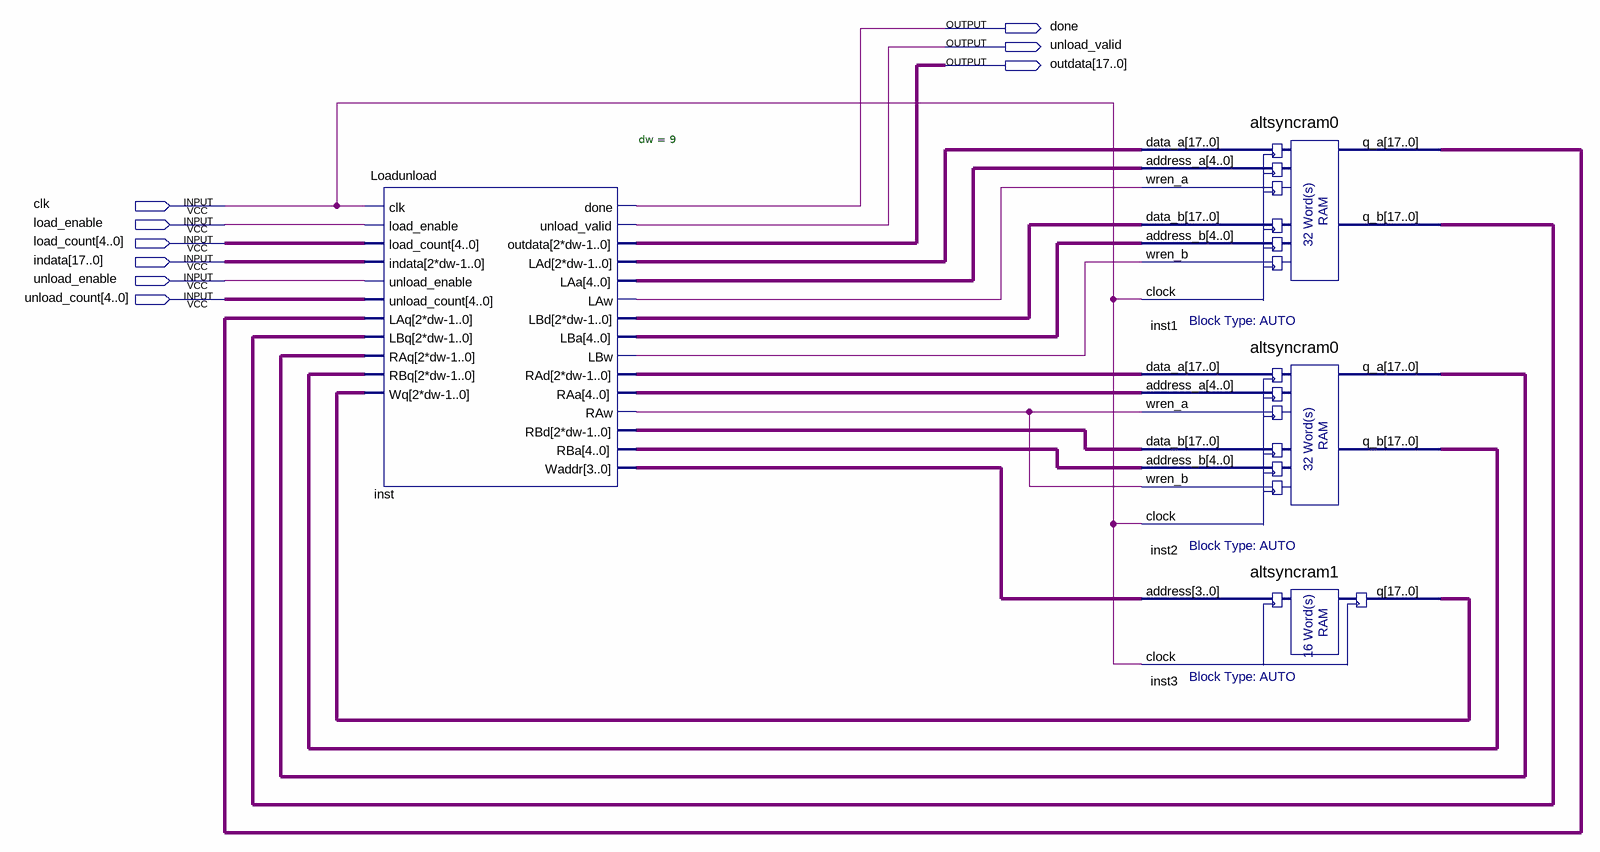
[diagram p0: schematic sheet]
// Quartus schematic FFT_engine.bdf as structural Verilog: 4 symbols, 9 pins
module FFT_engine (
  input  clk,
  input  load_enable,
  input  [4:0] load_count,
  input  [17:0] indata,
  input  unload_enable,
  input  [4:0] unload_count,
  output done,
  output unload_valid,
  output [17:0] outdata
);

  wire inst_law, inst_lbw, inst_raw;
  wire [3:0] inst_waddr;
  wire [4:0] inst_laa, inst_lba, inst_raa, inst_rba;
  wire [17:0] inst1_q_a, inst1_q_b, inst2_q_a, inst2_q_b, inst3_q, inst_lad, inst_lbd, inst_rad, inst_rbd;

  Loadunload #(.dw(9)) inst (
    .clk(clk), .load_enable(load_enable), .load_count(load_count), .indata(indata),
    .unload_enable(unload_enable), .unload_count(unload_count), .LAq(inst1_q_a), .LBq(inst1_q_b),
    .RAq(inst2_q_a), .RBq(inst2_q_b), .Wq(inst3_q), .done(done), .unload_valid(unload_valid),
    .outdata(outdata), .LAd(inst_lad), .LAa(inst_laa), .LAw(inst_law), .LBd(inst_lbd), .LBa(inst_lba),
    .LBw(inst_lbw), .RAd(inst_rad), .RAa(inst_raa), .RAw(inst_raw), .RBd(inst_rbd), .RBa(inst_rba),
    .Waddr(inst_waddr));
  altsyncram0 inst1 (
    .data_a(inst_lad), .address_a(inst_laa), .wren_a(inst_law), .data_b(inst_lbd), .address_b(inst_lba),
    .wren_b(inst_lbw), .clock(clk), .q_a(inst1_q_a), .q_b(inst1_q_b));
  altsyncram0 inst2 (
    .data_a(inst_rad), .address_a(inst_raa), .wren_a(inst_raw), .data_b(inst_rbd), .address_b(inst_rba),
    .wren_b(inst_raw), .clock(clk), .q_a(inst2_q_a), .q_b(inst2_q_b));
  altsyncram1 inst3 (.address(inst_waddr), .clock(clk), .q(inst3_q));
endmodule
